# Altium project External Power supply.PrjPcb
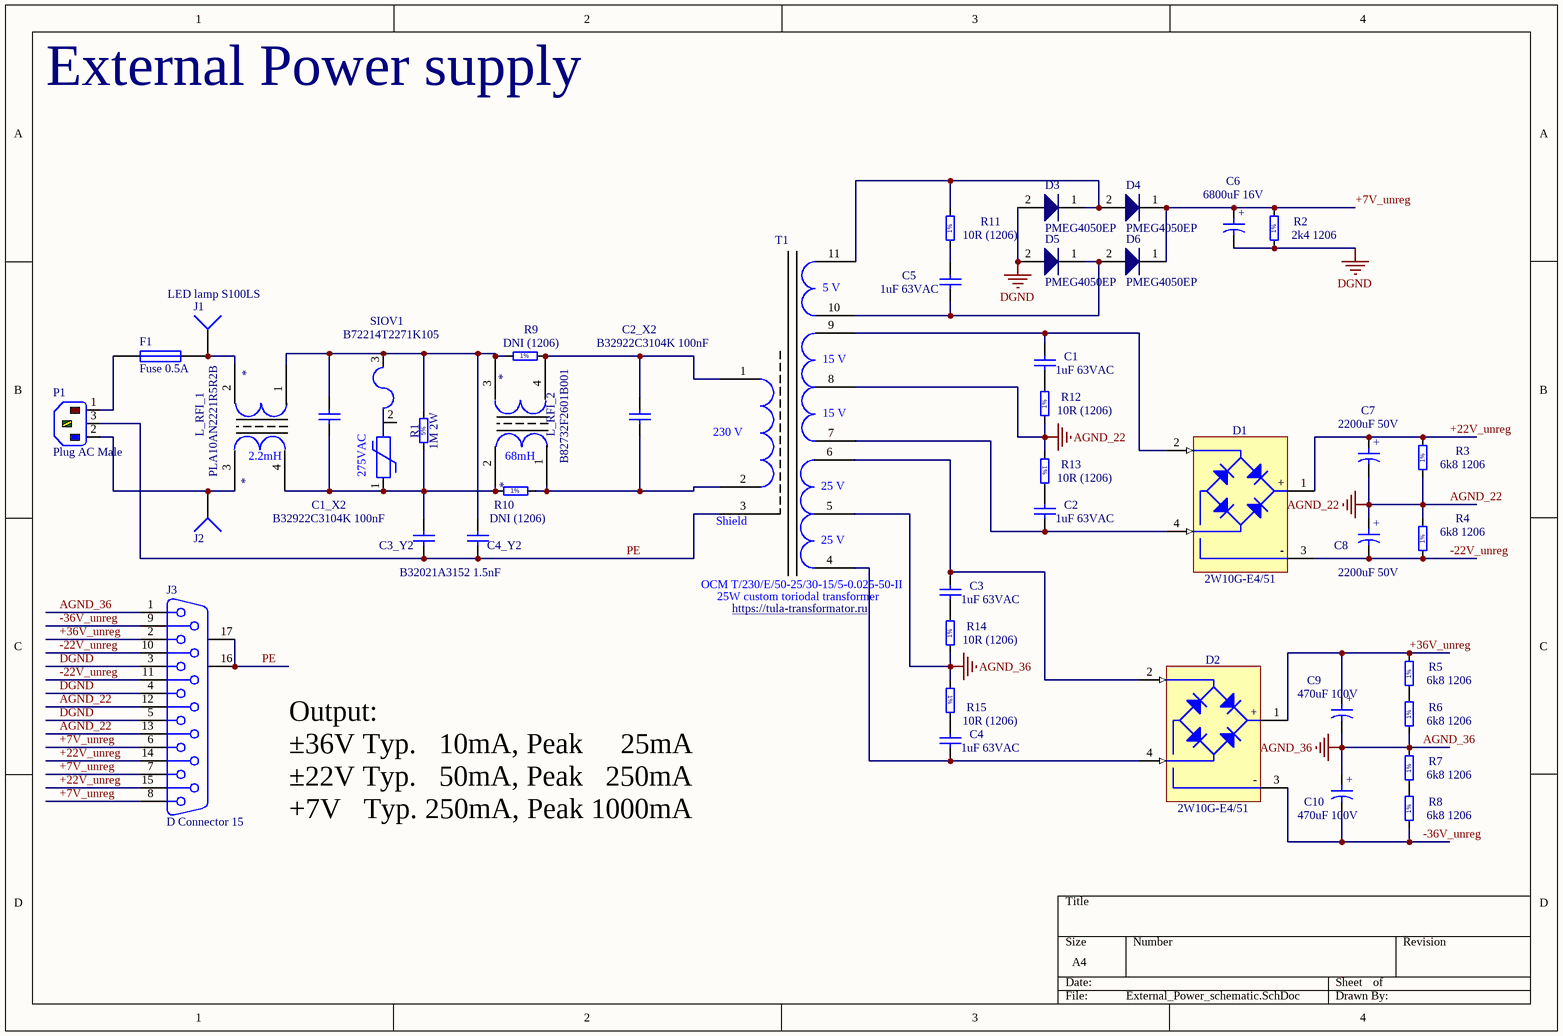
[diagram p0: External_Power_schematic.SchDoc]
1 sheet, 44 parts. Net scope: global (net labels, ports and power ports of the same name join across sheets).
Board file: External_Power_PCB.PcbDoc

## Sheet External_Power_schematic.SchDoc
size A4; SheetNumber: 1; SheetTotal: 1

### Parts
C1  1uF 63VAC  [B32522C1105]
C1_X2  B32922C3104K 100nF  [B32922D3334K]
C2  1uF 63VAC  [B32522C1105]
C2_X2  B32922C3104K 100nF  [B32922D3334K]
C3  1uF 63VAC  [B32522C1105]
C3_Y2  B32021A3152 1.5nF  [B32021A3152]
C4  1uF 63VAC  [B32522C1105]
C4_Y2  B32021A3152 1.5nF  [B32021A3152]  (value not drawn)
C5  1uF 63VAC  [B32522C1475]
C6  6800uF 16V  [CAPPR750-1850X3750]
C7  2200uF 50V  [CAPPR750-1850X3750]
C8  2200uF 50V  [CAPPR750-1850X3750]
C9  470uF 100V  [CAPPR750-1850X3750]
C10  470uF 100V  [CAPPR750-1850X3750]
D1  2W10G-E4/51  [VISHAY_WOG]
D2  2W10G-E4/51  [VISHAY_WOG]
D3  PMEG4050EP  [PMEG4050EP]
D4  PMEG4050EP  [PMEG4050EP]
D5  PMEG4050EP  [PMEG4050EP]
D6  PMEG4050EP  [PMEG4050EP]
F1  Fuse 0.5A  [FUSE]
J1  Socket  [PIN1]  (value not drawn)
J2  Socket  [PIN1]  (value not drawn)
J3  D Connector 15  [DSUB1.385-2H15]
L_RFI_1  PLA10AN2221R5R2B  [PLA10AN2221R5R2B]
L_RFI_2  B82732F2601B001  [B82732F]
P1  Plug AC Male  [AS-205]
R1  1M 2W  [RES_TYCO_CFR200]
R2  2k4 1206  [RESC3216X65N]
R3  6k8 1206  [RESC3216X65N]
R4  6k8 1206  [RESC3216X65N]
R5  6k8 1206  [RESC3216X65N]
R6  6k8 1206  [RESC3216X65N]
R7  6k8 1206  [RESC3216X65N]
R8  6k8 1206  [RESC3216X65N]
R9  DNI (1206)  [RESC3216X65N]
R10  DNI (1206)  [RESC3216X65N]
R11  10R (1206)  [RESC3216X65N]
R12  10R (1206)  [RESC3216X65N]
R13  10R (1206)  [RESC3216X65N]
R14  10R (1206)  [RESC3216X65N]
R15  10R (1206)  [RESC3216X65N]
SIOV1  B72214T2271K105  [B72214T2271K105]
T1  OCM T/230/E/50-25/30-15/5-0.025-50-II  [OCM T/230/E/50-25/30-15/5-0.025-50-II]  (value not drawn)

### Nets
AGND_22: C7.2 C8.1 J3.12 J3.13 R3.1 R4.2 R12.1 R13.1 T1.8
AGND_36: C9.2 C10.1 J3.1 R6.1 R7.2 R14.1 R15.1 T1.5
DGND: C6.2 D3.2 D5.2 J3.3 J3.4 J3.5 R2.1
+7V_unreg: C6.1 D4.1 D6.1 J3.6 J3.7 J3.8 R2.2
+22V_unreg: C7.1 D1.1(+) J3.14 J3.15 R3.2
+36V_unreg: C9.1 D2.1(+) J3.2 R5.2
-22V_unreg: C8.2 D1.3(-) J3.10 J3.11 R4.1
-36V_unreg: C10.2 D2.3(-) J3.9 R8.1
PE: C3_Y2.1 C4_Y2.1 J3.16(MH1) J3.17(MH2) P1.3(E) T1.3
NetC1_1: C1.1 R12.2
NetC1_2: C1.2 D1.2(AC) T1.9
NetC1_X2_1: C1_X2.1 C3_Y2.2 L_RFI_1.4 L_RFI_2.2 R1.1 R10.1 SIOV1.1
NetC1_X2_2: C1_X2.2 C4_Y2.2 L_RFI_1.1 L_RFI_2.3 R1.2 R9.1 SIOV1.3
NetC2_1: C2.1 D1.4(AC) T1.7
NetC2_2: C2.2 R13.2
NetC2_X2_1: C2_X2.1 L_RFI_2.1 R10.2 T1.2
NetC2_X2_2: C2_X2.2 L_RFI_2.4 R9.2 T1.1
NetC3_1: C3.1 R14.2
NetC3_2: C3.2 D2.2(AC) T1.6
NetC4_1: C4.1 D2.4(AC) T1.4
NetC4_2: C4.2 R15.2
NetC5_1: C5.1 D5.1 D6.2 T1.10
NetC5_2: C5.2 R11.1
NetD3_1: D3.1 D4.2 R11.2 T1.11
NetF1_1: F1.1 P1.1(L)
NetF1_2: F1.2 J1.1 L_RFI_1.2
NetJ2_1: J2.1 L_RFI_1.3 P1.2(N)
NetR5_1: R5.1 R6.2
NetR7_1: R7.1 R8.2

Not connected (* = marked no-connect by the designer): SIOV1 2

### Notes on the sheet
- External Power supply
- (near J1) LED lamp S100LS
- (near L_RFI_1) 2.2mH
- (near SIOV1) 275VAC
- (near L_RFI_2) 68mH
- Output:
  ±36V Typ.   10mA, Peak     25mA
  ±22V Typ.   50mA, Peak   250mA
  +7V   Typ. 250mA, Peak 1000mA
- (in symbol CAER_10000UF_16V_20%_CHEMI-CON_EKYB160ELL103MMP1S) +
- (in symbol OCM T/230/E/50-25/30-15/5-0.025-50-II) 5 V; 15 V; 230 V; 25 V; Shield; 25W custom toriodal transformer; https://tula-transformator.ru
- (in symbol R1206_2K4_1%_0.25W_100PPM) 1%
- (in symbol RCF_NO-VALUE_5%_2W_0-450PPM_TYCO_CFR200) 5%

### Library data of the parts
C1-C5 = CPPR_330NF_630V_5%_2250-1050X2650X1650: Non-polarised capacitor; Part Description: Metallized Polypropylene Film Capacitor (MKP); Manufacturer: TDK; Manufacturer Part Number: B32653A6334J000; Voltage: 630VDC/250VAC; Tolerance: ±5%; Part Number: CPPR_330NF_630V_5%_2250-1050X2650X1650; Component Kind: Standard; Component Type: Standard; Footprint: CAPR2250-1050X2650X1650; Pin Count: 2; Value: 1uF 63VAC; Status: None; Case: LS22.5 W10.5 x L26.5 x H16.5; Mounted: Yes; Socket: No; SMD: No; Sense: No; ComponentHeight: 16.5mm; HelpURL: \\cern.ch\dfs\Applications\Altium\Datasheets\CPPR_TDK_B32653.pdf; Author: CERN DEM JLC; CreateDate: 20.12.2007; LatestRevisionDate: 22.04.2015
C1_X2 C2_X2 C3_Y2 C4_Y2 = CPPR_330NF_630V_5%_2250-1050X2650X1650: Non-polarised capacitor; Part Description: Metallized Polypropylene Film Capacitor (MKP); Manufacturer: TDK; Manufacturer Part Number: B32653A6334J000; Value: 330nF; Voltage: 630VDC/250VAC; Tolerance: ±5%; Part Number: CPPR_330NF_630V_5%_2250-1050X2650X1650; Component Kind: Standard; Component Type: Standard; Footprint: CAPR2250-1050X2650X1650; Pin Count: 2; Status: None; Case: LS22.5 W10.5 x L26.5 x H16.5; Mounted: Yes; Socket: No; SMD: No; Sense: No; ComponentHeight: 16.5mm; HelpURL: \\cern.ch\dfs\Applications\Altium\Datasheets\CPPR_TDK_B32653.pdf; Author: CERN DEM JLC; CreateDate: 20.12.2007; LatestRevisionDate: 22.04.2015
C6 = CAER_10000UF_16V_20%_CHEMI-CON_EKYB160ELL103MMP1S: Polarised capacitor; Part Description: Z=0R012 Miniature Aluminium Electrolytic Capacitor; Manufacturer: UNITED CHEMI-CON; Tolerance: ±20%; Part Number: CAER_10000UF_16V_20%_CHEMI-CON_EKYB160ELL103MMP1S; Component Kind: Standard; Component Type: Standard; Pin Count: 2; Value: 6800uF 16V; Status: None; Voltage: 16V; Manufacturer Part Number: EKYB160ELL103MMP1S; Case: LS7.5 D18 x H35.5; Mounted: Yes; Socket: No; SMD: No; Sense: Yes; ComponentHeight: 37mm; HelpURL: \\cern.ch\dfs\Applications\Altium\Datasheets\CAER_CHEMI-CON_KYB.pdf; Author: CERN DEM JLC; CreateDate: 02.06.2015; LatestRevisionDate: 02.06.2015
C7-C10 = CAER_10000UF_16V_20%_CHEMI-CON_EKYB160ELL103MMP1S: Polarised capacitor; Part Description: Z=0R012 Miniature Aluminium Electrolytic Capacitor; Manufacturer: UNITED CHEMI-CON; Voltage: 16V; Tolerance: ±20%; Part Number: CAER_10000UF_16V_20%_CHEMI-CON_EKYB160ELL103MMP1S; Component Kind: Standard; Component Type: Standard; Pin Count: 2; Status: None; Manufacturer Part Number: EKYB160ELL103MMP1S; Case: LS7.5 D18 x H35.5; Mounted: Yes; Socket: No; SMD: No; Sense: Yes; ComponentHeight: 37mm; HelpURL: \\cern.ch\dfs\Applications\Altium\Datasheets\CAER_CHEMI-CON_KYB.pdf; Author: CERN DEM JLC; CreateDate: 02.06.2015; LatestRevisionDate: 02.06.2015
  C7 C8: Value: 2200uF 50V
  C9 C10: Value: 470uF 100V
D1 D2 = W005G-E4/51: Bridge Rectifier 1+ 2AC 3- 4AC; Part Description: Glass Passivated Single-Phase Bridge Rectifier; Manufacturer: VISHAY GENERAL SEMICONDUCTOR; Voltage: 50V; Power: 1.5A; PressFit: No; Bonding: No; Part Number: W005G-E4/51; Component Kind: Standard; Component Type: Standard; Device: 2W10G-E4/51; PackageDescription: Bridge Rectifier, Body 9.35m x 8.33mm, VISHAY Case Type WOG; Manufacturer Part Number: W005G-E4/51; Pin Count: 4; Mounted: Yes; Socket: No; SMD: No; Sense: No; ComponentHeight: 13.5mm; HelpURL: \\cern.ch\dfs\Applications\Altium\Datasheets\W005G-E4-51.pdf; Author: CERN DEM JLC; CreateDate: 20.09.2011; LatestRevisionDate: 08.04.2016
F1 = Fuse 1: Fuse; Published: 8-Jun-2000; LatestRevisionDate: 17-Jul-2002; LatestRevisionNote: Re-released for DXP Platform.; PackageReference: PIN-W2/E2.8; Publisher: Altium Limited; PackageDescription: Thru-Hole; 2 Leads
J3 = D Connector 15: Receptacle Assembly, 15 Position, Right Angle; PackageDocument: O; Positions: 15; Published: 15-Jun-2001; LatestRevisionDate: 17-Jul-2002; LatestRevisionNote: Re-released for DXP Platform.; DatasheetDocument: 1-Sep-99; PackageReference: 788757; Publisher: Altium Limited; Orientation: Right Angle; Gender: Receptacle; System: Connector
L_RFI_2 = PLA10AN2221R5R2B
P1 = Plug AC Male: IEC Mains Power Inlet, EN60 320-1 C14 Class I Cold Condition, PC Flange Rear Mount, Chassis Plug; PackageDocument: ver.80, 15-Sep-2003; MaximumRating: 10A, 250V a.c. (UL & CSA 15A, 250V a.c.); MountingFixtures: Not drawn on schematic symbol.; PCB_Layout: Complies with manufacturer's recommendation.; DrillSize: Corresponds to nominal value.; Note: IEC Color Scheme employed for L, N and E.; Published: 15-Jul-2004; LatestRevisionDate: 15-Jul-2004; LatestRevisionNote: Component Replaced.; DatasheetDocument: ver.80, 15-Sep-2003; PackageReference: PX0580/PC; Publisher: Altium Limited; Terminations: P.C. Spills; ComponentLink1Description: Manufacturer Link; ComponentLink1URL: http://www.bulgin.co.uk/
R1 = RCF_NO-VALUE_5%_2W_0-450PPM_TYCO_CFR200: Resistor - 5%; Part Description: Carbon Film Fixed Resistor - CFR  Series; Manufacturer: TYCO ELECTRONICS; Manufacturer Part Number: CFR200J; TC: 0 -450ppm/°C; PressFit: No; Mounted: No; Part Number: RCF_NO-VALUE_5%_2W_0-450PPM_TYCO_CFR200; Component Kind: Standard; Component Type: Standard; Pin Count: 2; Value: 1M 2W; Status: None; Power: 2W; Tolerance: ±5%; Case: LS20.32 L16 x D5.5; Sense: No; Socket: No; SMD: No; ComponentHeight: 5.5mm; HelpURL: \\cern.ch\dfs\Applications\Altium\Datasheets\RCF_TYCO_CFR200.pdf; Author: CERN DEM JLC; CreateDate: 10.03.2014; LatestRevisionDate: 03.06.2014
R2-R15 = R1206_2K4_1%_0.25W_100PPM: Resistor - 1%; Part Description: General Purpose Thick Film Chip Resistor; Manufacturer: GENERIC; Manufacturer1 Part Number: NRC12F2401TRF; Power: 0.25W; TC: ±100ppm/°C; PressFit: No; Part Number: R1206_2K4_1%_0.25W_100PPM; Component Kind: Standard; Component Type: Standard; Pin Count: 2; Status: Preferred; Tolerance: ±1%; Manufacturer Part Number: R1206_2K4_1%_0.25W_100PPM; Case: 1206; Mounted: Yes; Sense: No; Socket: No; SMD: Yes; Manufacturer1 Example: NIC COMPONENT; Manufacturer1 ComponentHeight: 0.65mm; HelpURL: \\cern.ch\dfs\Applications\Altium\Datasheets\R1206_NIC_NRC.pdf; Author: CERN DEM JLC; CreateDate: 03.12.2007; LatestRevisionDate: 13.03.2008
  R2: Value: 2k4 1206
  R3-R8: Value: 6k8 1206
  R9 R10: Value: DNI (1206)
  R11-R15: Value: 10R (1206)
J1 J2 = Socket: LatestRevisionDate: 17-Jul-2002; LatestRevisionNote: Re-released for DXP Platform.; Publisher: Altium Limited
SIOV1 = B72214T2271K105: Published: 8-Jun-2000; LatestRevisionDate: 29-May-2009; LatestRevisionNote: IPC-7351 Footprint Added.; PackageReference: J1-0603; Publisher: Altium Limited; PackageDescription: Chip Resistor; Order: B72214T2271K105